# Altium schematic sheet ra-02com.schdoc
size 121 x 72 mm
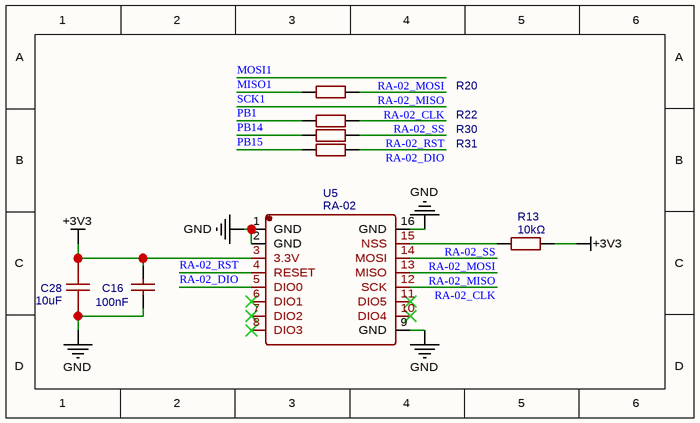
[diagram p0: ra-02com.schdoc]

## Parts
C16  100nF  [C0402]
C28  10uF  [C0603]
R13  10kΩ  [R0402]
R20  22Ω  [R0402]  (value not drawn)
R22  22Ω  [R0402]  (value not drawn)
R30  22Ω  [R0402]  (value not drawn)
R31  22Ω  [R0402]  (value not drawn)
U5  RA-02  [WIRELM-SMD_RA-02-BL]

## Nets
+3V3: C16.2 C28.1 R13.2 U5.3(3.3V)
GND: C16.1 C28.2 U5.1(GND) U5.2(GND) U5.9(GND) U5.16(GND)
MISO1: R20.1
MOSI1: U5.14(MOSI)  [also labelled RA-02_MOSI]
PB1: R22.1
PB14: R30.1
PB15: R31.1
RA-02_CLK: U5.12(SCK)  [also labelled SCK1]
RA-02_DIO: R31.2 U5.5(DIO0)
RA-02_MISO: R20.2 U5.13(MISO)
RA-02_RST: R30.2 U5.4(RESET)
RA-02_SS: R13.1 R22.2 U5.15(NSS)

Not connected (* = marked no-connect by the designer): U5 6(DIO1)* 7(DIO2)* 8(DIO3)* 10(DIO4)* 11(DIO5)*

## Library data of the parts
C16 = 100nF: Manufacturer Part: CL05B104KO5NNNC; Manufacturer: SAMSUNG(三星); nameAlias: Value; Supplier: LCSC; Supplier Part: C1525; JLCPCB Part Class: Basic Part; spicePre: C; spiceSymbolName: CL05B104KO5NNNC
C28 = 10uF: Manufacturer: SAMSUNG(三星); Manufacturer Part: CL10A106MA8NRNC; nameAlias: Value; Supplier: LCSC; Supplier Part: C96446; JLCPCB Part Class: Basic Part; spicePre: C; spiceSymbolName: CL10A106MA8NRNC
R13 = 10kΩ: Manufacturer: UNI-ROYAL(厚声); Manufacturer Part: 0402WGF1002TCE; nameAlias: Value; Supplier: LCSC; Supplier Part: C25744; JLCPCB Part Class: Basic Part; spicePre: R; spiceSymbolName: 0402WGF1002TCE
R20 R22 R30 R31 = 22Ω: Manufacturer: UNI-ROYAL(厚声); Manufacturer Part: 0402WGF220JTCE; nameAlias: Value; Supplier: LCSC; Supplier Part: C25092; JLCPCB Part Class: Basic Part; spicePre: R; spiceSymbolName: 0402WGF220JTCE
U5 = RA-02: Manufacturer: Ai-Thinker(安信可); Contributor: LCSC; Supplier: LCSC; Supplier Part: C90039; Manufacturer Part: Ra-02; JLCPCB Part Class: Extended Part; spicePre: U; spiceSymbolName: RA-02